# EAGLE design design (EAGLE 9.5.2)
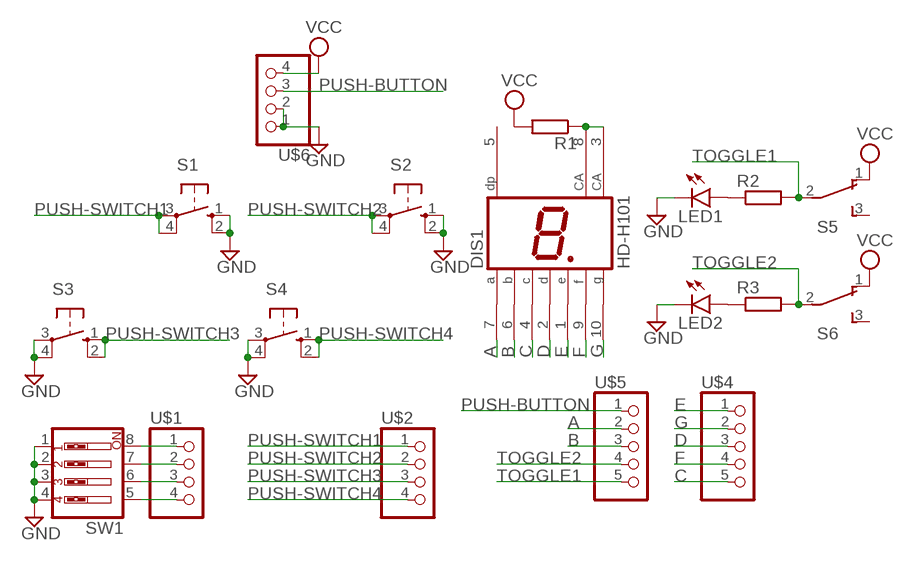
[diagram p0: schematic, sheet 1]

## Parts
DIS1  HD-H101  [HDSP-M]
LED1  LED5MM  [LED5MM]
LED2  LED5MM  [LED5MM]
R1  R-EU_0207/10  [0207/10]
R2  R-EU_0207/10  [0207/10]
R3  R-EU_0207/10  [0207/10]
S1  10-XX  [B3F-10XX]
S2  10-XX  [B3F-10XX]
S3  10-XX  [B3F-10XX]
S4  10-XX  [B3F-10XX]
S5  TL36PO  [TL3XPO]
S6  TL36PO  [TL3XPO]
SW1  SW_DIP-4  [EDG-04]
U$1  ABOUTERS_4PIN  [22-23-2041]
U$2  ABOUTERS_4PIN  [22-23-2041]
U$4  ABOUTERS_5PIN  [22-23-2051]
U$5  ABOUTERS_5PIN  [22-23-2051]
U$6  ABOUTERS_4PIN  [22-23-2041]

## Nets
A: DIS1.7(A) U$5.2
B: DIS1.6(B) U$5.3
C: DIS1.4(C) U$4.5
D: DIS1.2(D) U$4.3
E: DIS1.1(E) U$4.1
F: DIS1.9(F) U$4.4
G: DIS1.10(G) U$4.2
GND: LED1.K(C) LED2.K(C) S1.1(S) S1.2(S1) S2.1(S) S2.2(S1) S3.3(P) S3.4(P1) S4.3(P) S4.4(P1) SW1.1 SW1.2 SW1.3 SW1.4 U$6.1 U$6.2
N$1: DIS1.3(CA) DIS1.8(CA) R1.1
N$2: SW1.8 U$1.1
N$3: SW1.7 U$1.2
N$4: SW1.6 U$1.3
N$5: SW1.5 U$1.4
N$8: LED1.A R2.1
N$9: LED2.A R3.1
PUSH-BUTTON: U$5.1 U$6.3
PUSH-SWITCH1: S1.3(P) S1.4(P1) U$2.1
PUSH-SWITCH2: S2.3(P) S2.4(P1) U$2.2
PUSH-SWITCH3: S3.1(S) S3.2(S1) U$2.3
PUSH-SWITCH4: S4.1(S) S4.2(S1) U$2.4
TOGGLE1: R2.2 S5.2(P) U$5.5
TOGGLE2: R3.2 S6.2(P) U$5.4
VCC: R1.2 S5.1(O) S6.1(O) U$6.4
Unconnected: DIS1.5(DP) S5.3(S) S6.3(S)

## Library data of the parts
DIS1 = display-hp:HD-H101: LED DISPLAY 1-character 7 segment, decimal point right; OC_FARNELL: unknown; OC_NEWARK: unknown
LED1 LED2 = led:LED: LED OSRAM: - CHIPLED LG R971, LG N971, LY N971, LG Q971, LY Q971, LO R971, LY R971 LH N974, LH R974 LS Q976, LO Q976, LY Q976 LO Q996 - Hyper CHIPLED LW Q18S LB Q993, LB Q99A, LB R99A - SideLED LS A670, LO A670, LY A670, LG A670, LP A670 LB A673, LV A673, LT A673, LW A673 LH A674 LY A675 LS A676, LA A676, LO A676, LY A676, LW A676 LS A679, LY A679, LG A679 - Hyper Micro SIDELED® LS Y876, LA Y876, LO Y876, LY Y876 LT Y87S - SmartLED LW L88C, LW L88S LB L89C, LB L89S, LG L890 LS L89K, LO L89K, LY L89K LS L896, LA L896, LO L896, LY L896 - TOPLED LS T670, LO T670, LY T670, LG T670, LP T670 LSG T670, LSP T670, LSY T670, LOP T670, LYG T670 LG T671, LOG T671, LSG T671 LB T673, LV T673, LT T673, LW T673 LH T674 LS T676, LA T676, LO T676, LY T676, LB T676, LH T676, LSB T676, LW T676 LB T67C, LV T67C, LT T67C, LS T67K, LO T67K, LY T67K, LW E67C LS E67B, LA E67B, LO E67B, LY E67B, LB E67C, LV E67C, LT E67C LW T67C LS T679, LY T679, LG T679 LS T770, LO T770, LY T770, LG T770, LP T770 LB T773, LV T773, LT T773, LW T773 LH T774 LS E675, LA E675, LY E675, LS T675 LS T776, LA T776, LO T776, LY T776, LB T776 LHGB T686 LT T68C, LB T68C - Hyper Mini TOPLED® LB M676 - Mini TOPLED Santana® LG M470 LS M47K, LO M47K, LY M47K Source: http://www.osram.convergy.de LUXEON: - LUMILED® LXK2-PW12-R00, LXK2-PW12-S00, LXK2-PW14-U00, LXK2-PW14-V00 LXK2-PM12-R00, LXK2-PM12-S00, LXK2-PM14-U00 LXK2-PE12-Q00, LXK2-PE12-R00, LXK2-PE12-S00, LXK2-PE14-T00, LXK2-PE14-U00 LXK2-PB12-K00, LXK2-PB12-L00, LXK2-PB12-M00, LXK2-PB14-N00, LXK2-PB14-P00, LXK2-PB14-Q00 LXK2-PR12-L00, LXK2-PR12-M00, LXK2-PR14-Q00, LXK2-PR14-R00 LXK2-PD12-Q00, LXK2-PD12-R00, LXK2-PD12-S00 LXK2-PH12-R00, LXK2-PH12-S00 LXK2-PL12-P00, LXK2-PL12-Q00, LXK2-PL12-R00 Source: www.luxeon.com KINGBRIGHT: KA-3528ASYC Source: www.kingbright.com
R1-R3 = rcl:R-EU_: RESISTOR, European symbol; SPICEPREFIX: R
S1-S4 = switch-omron:10-XX: OMRON SWITCH; MPN: B3F-1000; OC_FARNELL: 176432; OC_NEWARK: 36M3542
S5 S6 = switch:TL36PO: TINY SWITCH ON - ON Source: http://www2.produktinfo.conrad.com/datenblaetter/700000-724999/705152-da-01-de-Subminiaturschalter_TL_36YO.pdf
SW1 = special:SW_DIP-4: DIP SWITCH
U$1 U$2 U$6 = abouters_pin :ABOUTERS_4PIN
U$4 U$5 = abouters_pin :ABOUTERS_5PIN

## Board
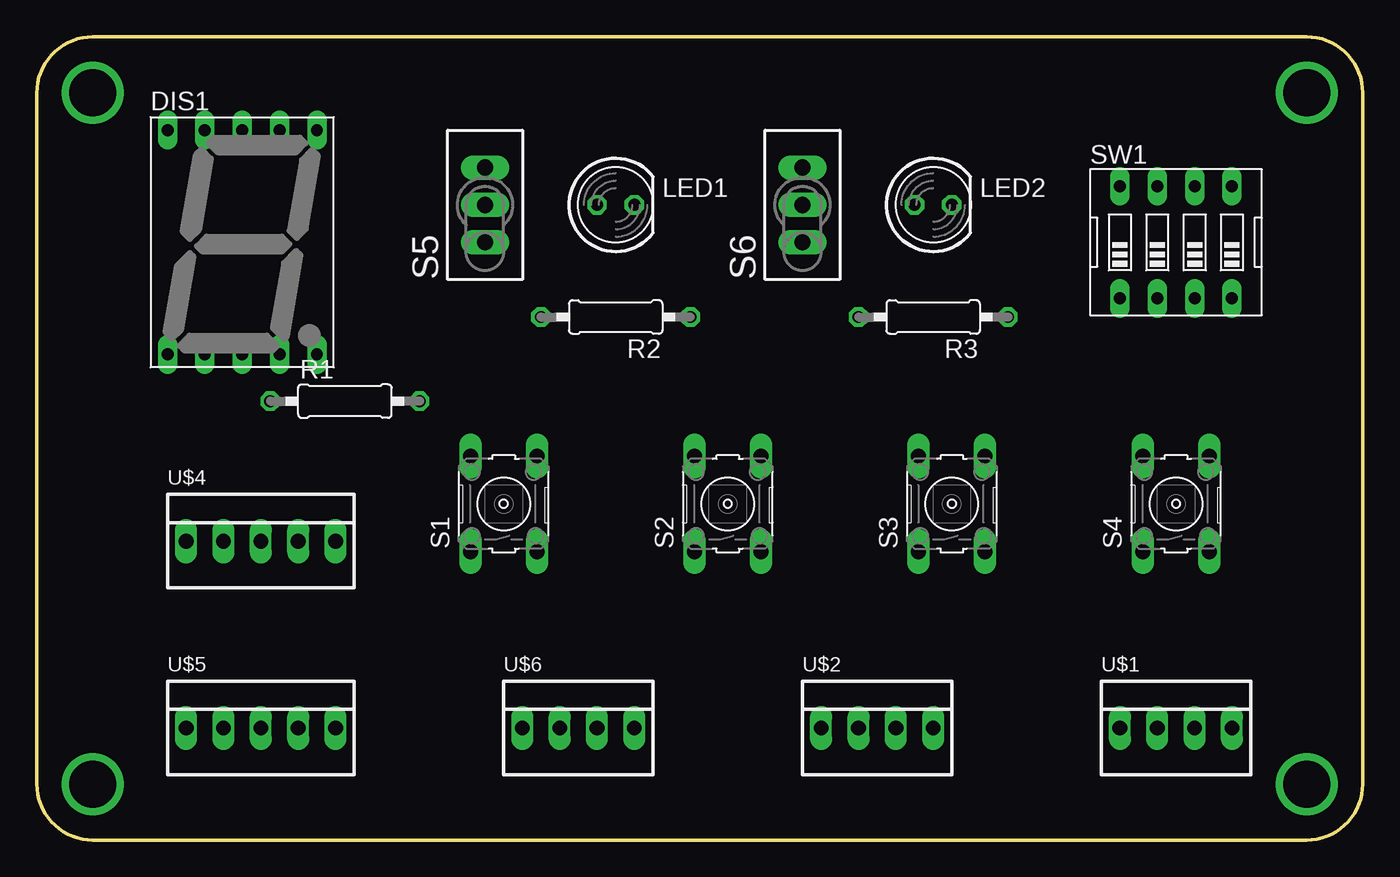
[diagram p1: board, top side]
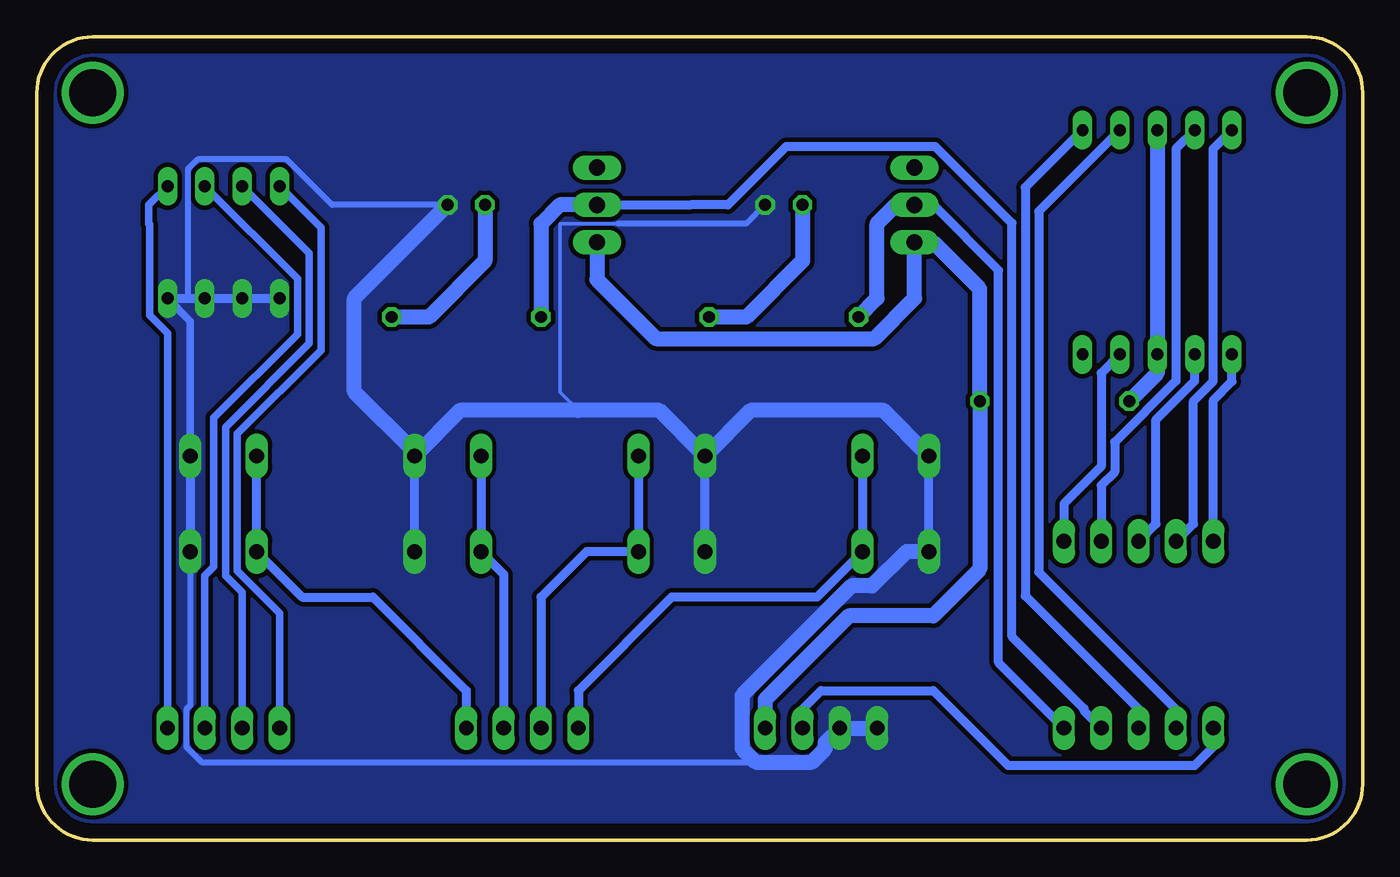
[diagram p2: board, bottom side, seen from below]

Size 90.17 x 54.61 mm. Coordinates in mm from the lower left corner, seen from the top.
Outline: 0,50.8 0,3.81 arc90 3.81,0 86.36,0 arc90 90.17,3.81 90.17,50.8 arc90 86.36,54.61 3.81,54.61 arc90 0,50.8
Copper layers (1*16): Top 0.035mm / dielectric 1.5mm / Bottom 0.035mm
Design rules "default *": minimum track width 6mil, minimum drill 0.35mm, track to track 0.3mm, track to pad 0.3mm, pad to pad 0.3mm, via to via 0.3mm, smd to smd 0.3mm, copper to edge 40mil, drill to drill 6mil, minimum pad ring 10mil, minimum via ring 8mil, stop-mask expansion 4mil, vias tented up to drill 0mil, thermal gap 10mil

### Footprints (pad centres in the part's own frame; a part is rotated, then mirrored left to right if it is on the bottom)
HDSP-M = drill 0.813 long: 1 -5.08,-7.62; 2 -2.54,-7.62; 3 0,-7.62; 4 2.54,-7.62; 5 5.08,-7.62; 6 5.08,7.62; 7 2.54,7.62; 8 0,7.62; 9 -2.54,7.62; 10 -5.08,7.62
LED5MM = drill 0.813 octagon: A -1.27,0; K 1.27,0
0207/10 = drill 0.813 octagon: 1 -5.08,0; 2 5.08,0
B3F-10XX = drill 1.016 long: 1 -3.251,2.261; 2 3.251,2.261; 3 -3.251,-2.261; 4 3.251,-2.261
TL3XPO = drill 1.1 pad 1.422 long: 1 -2.54,0; 2 0,0; 3 2.54,0
EDG-04 = drill 0.813 long: 1 -3.81,-3.81; 2 -1.27,-3.81; 3 1.27,-3.81; 4 3.81,-3.81; 5 3.81,3.81; 6 1.27,3.81; 7 -1.27,3.81; 8 -3.81,3.81
22-23-2041 = drill 1 long: 1 -3.81,0; 2 -1.27,0; 3 1.27,0; 4 3.81,0
22-23-2051 = drill 1 long: 1 -5.08,0; 2 -2.54,0; 3 0,0; 4 2.54,0; 5 5.08,0

### Placement (x,y rotation side)
DIS1  13.97,40.64 0 top
LED1  39.37,43.18 0 top
LED2  60.96,43.18 0 top
R1  20.95,29.84 0 top
R2  39.37,35.56 180 top
R3  60.96,35.56 180 top
S1  31.75,22.86 90 top
S2  46.99,22.86 90 top
S3  62.23,22.86 90 top
S4  77.47,22.86 90 top
S5  30.48,43.18 90 top
S6  52.07,43.18 90 top
SW1  77.47,40.64 0 top
U$1  77.47,7.62 0 top
U$2  57.15,7.62 0 top
U$4  15.24,20.32 0 top
U$5  15.24,7.62 0 top
U$6  36.83,7.62 0 top

### Tracks (layer width: path | path; a pad name or v marks a point on that pad's centre or on a via)
A
  Bottom 0.61: U$5.2 12.7,8.89 22.04,18.23 22.04,42.73 DIS1.7
B
  Bottom 0.61: U$5.3 15.24,8.89 22.95,16.6 22.95,44.36 DIS1.6
C
  Bottom 0.61: DIS1.4 17.78,31.75 17.78,25.4 20.32,22.86 U$4.5
D
  Bottom 0.61: U$4.3 14.06,21.5 14.06,28.59 11.43,31.21 DIS1.2
E
  Bottom 0.61: U$4.1 10.16,29.91 8.89,31.18 DIS1.1
F
  Bottom 0.61: DIS1.9 12.7,46.98 12.7,31.23 16.87,27.06 16.87,25.02 17.78,24.11 U$4.4
G
  Bottom 0.61: U$4.2 11.52,21.5 11.52,29.84 10.17,31.19 10.17,46.98 DIS1.10
GND
  Bottom 0.254: 53.34,29.21 54.58,30.45 54.58,41.88 54.56,41.91 50.71,41.91
  Bottom 0.305: 50.64,41.91 50.71,41.91
  Bottom 0.406: LED2.K 70.08,43.18 73.18,46.27 79.22,46.27 79.9,45.59 79.9,36.94 80.01,36.83 | S4.3 79.73,9.16 80,8.89 80,6.35 78.96,5.3 41.29,5.3 | LED1.K 41.91,41.91 50.64,41.91
  Bottom 0.508: S4.4 79.73,35.28 SW1.4
  Bottom 0.61: SW1.4 80.01,36.83 SW1.3 SW1.2 SW1.1 | S4.4 S4.3 | S3.3 S3.4 | S2.1 S2.2 | S1.1 S1.2
  Bottom 1.016: LED2.K 68.58,36.83 68.58,30.48 64.49,26.39 S3.4 61.39,29.21 53.34,29.21 47.83,29.21 S2.2 41.63,29.21 32.59,29.21 S1.2 | U$6.1 U$6.2 36.54,6.64 36.54,6.22 37.45,5.3 41.29,5.3 42.2,6.22 42.2,9.84 34.77,17.28 33.36,17.28 31.03,19.61 S1.1
  pour Bottom (no thermals): 0,54.61 0,0 90.17,0 90.17,54.61
N$1
  Bottom 1.016: DIS1.8 DIS1.3 13.97,31.75 R1.1
N$2
  Bottom 0.508: U$1.1 73.66,15.44 76.52,18.3 76.52,27.62 70.83,33.31 70.83,41.62 SW1.8
N$3
  Bottom 0.508: U$1.2 76.2,16.83 77.33,17.97 77.33,28.08 71.64,33.77 71.64,39.89 SW1.7
N$4
  Bottom 0.508: U$1.3 78.74,17.98 78.14,18.58 78.14,28.7 72.45,34.4 72.45,38.16 SW1.6
N$5
  Bottom 0.508: U$1.4 81.28,34.45 82.49,35.67 82.49,41.85 82.55,41.91 82.55,43.18 SW1.5
N$8
  Bottom 1.016: LED1.A 38.1,39.37 41.91,35.56 R2.1
N$9
  Bottom 1.016: LED2.A 59.69,39.37 63.5,35.56 R3.1
N$18  (via drill 3.2)
  other vias: 3.81,50.8
N$19  (via drill 3.2)
  other vias: 3.81,3.81
N$20  (via drill 3.2)
  other vias: 86.36,50.8
N$21  (via drill 3.2)
  other vias: 86.36,3.81
PUSH-BUTTON
  Bottom 0.61: U$6.3 38.1,8.89 36.83,10.16 29.21,10.16 24.13,5.08 11.43,5.08 10.16,6.35 U$5.1
PUSH-SWITCH1
  Bottom 0.61: S1.4 S1.3 37.11,16.51 46.99,16.51 53.34,10.16 U$2.1
PUSH-SWITCH2
  Bottom 0.61: S2.4 S2.3 52.78,19.61 55.88,16.51 U$2.2
PUSH-SWITCH3
  Bottom 0.61: S3.2 S3.1 58.42,18.06 U$2.3
PUSH-SWITCH4
  Bottom 0.61: S4.2 S4.1 72.11,16.51 67.31,16.51 60.96,10.16 U$2.4
TOGGLE1
  Bottom 0.61: S5.2 29.21,43.18 24.77,38.73 24.77,12.06 U$5.5
  Bottom 1.016: R2.2 33.02,36.83 33.02,41.91 31.75,43.18 S5.2
TOGGLE2
  Bottom 0.61: S6.2 45.72,43.18 43.18,43.18 39.21,47.15 35.92,47.15 35.56,47.15 29.06,47.15 23.86,41.94 23.86,13.83 18.96,8.94 18.96,8.8 U$5.4
  Bottom 1.016: S6.2 54.61,43.18 55.88,41.91 R3.2
VCC
  Bottom 1.016: S6.1 52.07,38.1 48.06,34.09 33.22,34.09 30.48,36.83 S5.1 29.21,40.64 26.03,37.47 R1.2 26.03,18.41 29.21,15.24 34.95,15.24 40.64,9.54 U$6.4